# Altium schematic sheet Principles_of_control.SchDoc
size A3
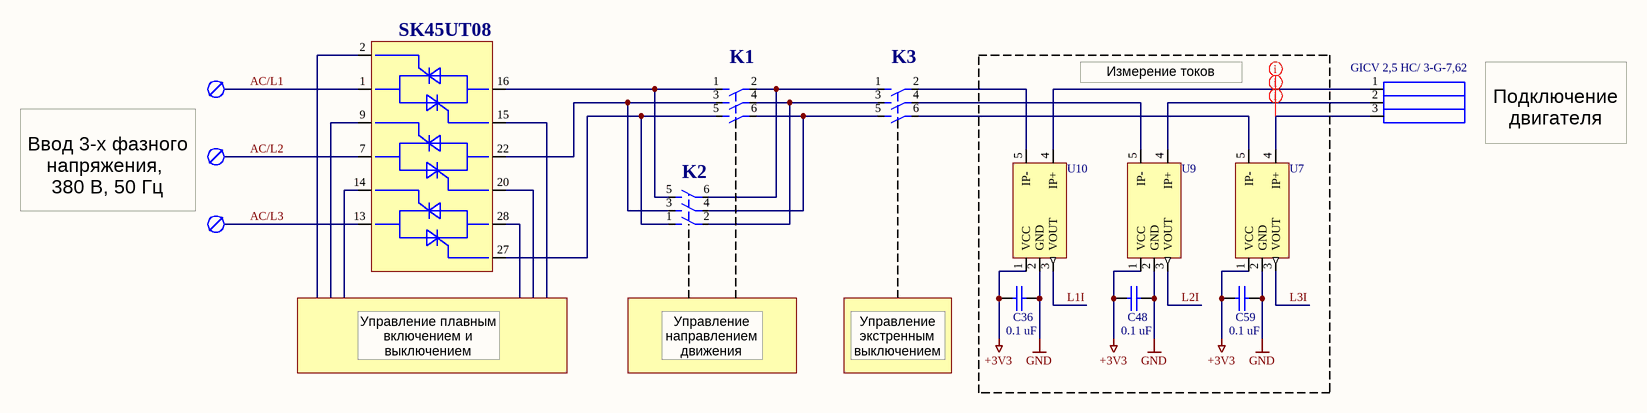
[diagram p0: Principles_of_control.SchDoc]

## Parts
C36  value 0.1 uF  [1608[0603]]  (hidden comment: CL10B104KA8NNND)
C48  value 0.1 uF  [1608[0603]]  (hidden comment: CL10B104KA8NNND)
C59  value 0.1 uF  [1608[0603]]  (hidden comment: CL10B104KA8NNND)
K1  3TF2001-6BB4  [3TF2010-6]  (value not drawn)  (part A of 3)
K2  3TF2001-6BB4  [3TF2010-6]  (value not drawn)  (part A of 3)
K3  3TF2001-6BB4  [3TF2010-6]  (value not drawn)  (part A of 3)
MOD1  SK45UT08  [SK45UT08]  (value not drawn)
U7  ACS759LCB-050B-PFF-T  [ACS756]  (value not drawn)
U9  ACS759LCB-050B-PFF-T  [ACS756]  (value not drawn)
U10  ACS759LCB-050B-PFF-T  [ACS756]  (value not drawn)
X23  GICV 2,5 HC/ 3-G-7,62  [1756498 GICV 2,5 HC/ 3-G-7,62]

## Nets
+3V3: C36.1 C48.1 C59.1 U7.1(VCC) U9.1(VCC) U10.1(VCC)
GND: C36.2 C48.2 C59.2 U7.2(GND) U9.2(GND) U10.2(GND)
AC/L1: MOD1.1
AC/L2: MOD1.7
AC/L3: MOD1.13
L1I: U10.3(VOUT)
L2I: U9.3(VOUT)
L3I: U7.3(VOUT)
NetK1_1: K1.1 K2.5 MOD1.16
NetK1_2: K1.2 K2.6 K3.1
NetK1_3: K1.3 K2.3 MOD1.22
NetK1_4: K1.4 K2.2 K3.3
NetK1_5: K1.5 K2.1 MOD1.27
NetK1_6: K1.6 K2.4 K3.5
NetK3_2: K3.2 U10.5(IP-)
NetK3_4: K3.4 U9.5(IP-)
NetK3_6: K3.6 U7.5(IP-)
NetU7_4: U7.4(IP+) X23.3
NetU9_4: U9.4(IP+) X23.2
NetU10_4: U10.4(IP+) X23.1

Not connected (* = marked no-connect by the designer): MOD1 2 9 14 15 20 28

## Layout directives
net class L1: NetU10_4
net class L2: NetU9_4
net class L3: NetU7_4

## Notes on the sheet
- (near MOD1) SK45UT08
- (near K1) K1
- (near K3) K3
- Измерение токов
- Подключение двигателя
- Ввод 3-х фазного напряжения,
  380 В, 50 Гц
- (near K2) K2
- Управление плавным включением и выключением
- Управление направлением движения
- Управление экстренным выключением

## Library data of the parts
C36 C48 C59 = CVNF100K0603-25: 0.1 uF, 25V, 10% , X7R,  0603 SMD MLC Capacitor; Manufacturer: SAMSUNG; Tolerance: 10%; Distributor: Future; Price: 0.0026 Euro; Voltage: 25 V; PartNum: CL10B104KA8NNND; PartName: CL10B104KA8NNND
K1-K3 = 3TF2001-6BB4: Contactor: 3-pole; Auxiliary contacts: NC; 24VDC; 9A; NO x3; PCB; Manufacturer: Siemens; PartNum: 3TF2001-6BB4; Distributor: TME; Price: 57.14; PartName: 3TF2001-6BB4
MOD1 = SK45UT08: 47A 800V thyristor module; Manufacturer: Semikron; Distributor: sindopower.com; PartName: SK45UT08; PartNum: SK45UT08
U7 U9 U10 = ACS759LCB-050B-PFF-T: IC HALL EFFECT SENSOR 50A, 3V; Manufacturer: Allegro Microsystems Inc; PartNum: 620-1467-5-ND; Price: 4.66$; Distributor: DigiKey; PartName: ACS759LCB-050B-PFF-T
X23 = GICV 2,5 HC/ 3-G-7,62: Header, Nominal current: 16 A, Rated voltage (III/2): 320 V, Number of positions: 3, Pitch: 5.08 mm, Color: green; Manufacturer: PHOENIX CONTACT; PartNum: 1756498; Distributor: PHOENIX CONTACT; Price: 0.99 Euro; PartName: GICV 2,5 HC/ 3-G-7,62